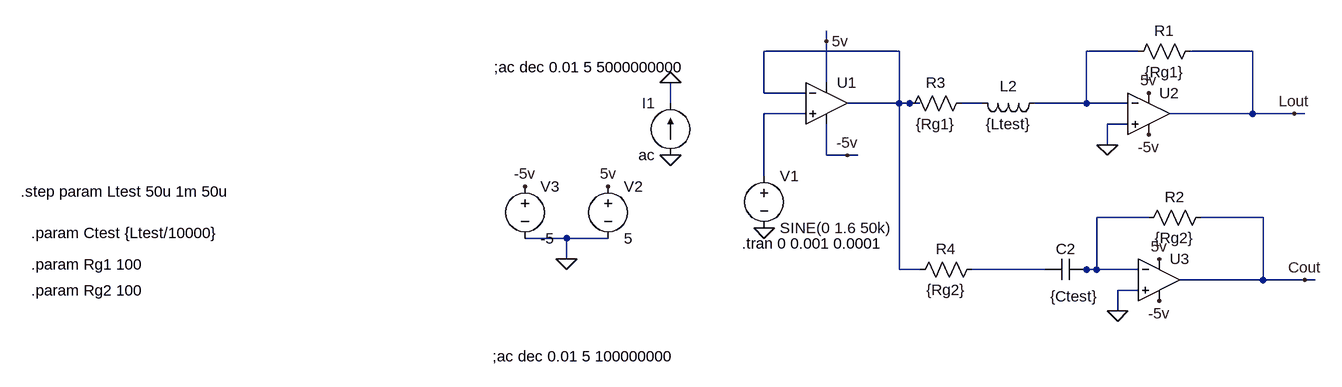
[diagram p0: schematic RLC_idealopamp.asc]
RLC_idealopamp.asc, the LTspice schematic file:
Version 4
SHEET 1 964 680
WIRE 112 32 112 16
WIRE 224 48 16 48
WIRE 592 48 512 48
WIRE 768 48 672 48
WIRE 112 96 112 32
WIRE 16 112 16 48
WIRE 80 112 16 112
WIRE -128 128 -128 96
WIRE 224 128 224 48
WIRE 224 128 144 128
WIRE 240 128 224 128
WIRE 256 128 240 128
WIRE 352 128 320 128
WIRE 512 128 512 48
WIRE 512 128 432 128
WIRE 576 128 512 128
WIRE 80 144 16 144
WIRE 768 144 768 48
WIRE 768 144 640 144
WIRE 832 144 768 144
WIRE 848 144 832 144
WIRE 576 160 544 160
WIRE 544 192 544 160
WIRE 112 208 112 160
WIRE 144 208 112 208
WIRE 160 208 144 208
WIRE 16 240 16 144
WIRE 608 304 528 304
WIRE 784 304 688 304
WIRE -288 336 -352 336
WIRE -224 336 -288 336
WIRE -288 368 -288 336
WIRE 224 384 224 128
WIRE 256 384 224 384
WIRE 448 384 336 384
WIRE 512 384 496 384
WIRE 528 384 528 304
WIRE 528 384 512 384
WIRE 592 384 528 384
WIRE 784 400 784 304
WIRE 784 400 656 400
WIRE 848 400 784 400
WIRE 864 400 848 400
WIRE 592 416 560 416
WIRE 560 448 560 416
FLAG 16 320 0
FLAG 544 192 0
FLAG -288 368 0
FLAG -224 256 5v
FLAG 112 32 5v
FLAG 608 112 5v
FLAG -352 256 -5v
FLAG 144 208 -5v
FLAG 608 176 -5v
FLAG 560 448 0
FLAG 624 368 5v
FLAG 624 432 -5v
FLAG 848 400 Cout
FLAG 832 144 Lout
FLAG -128 208 0
FLAG -128 96 0
SYMBOL voltage 16 224 R0
WINDOW 123 0 0 Left 0
WINDOW 39 0 0 Left 0
SYMATTR InstName V1
SYMATTR Value SINE(0 1.6 50k)
SYMBOL res 688 32 R90
WINDOW 0 0 56 VBottom 2
WINDOW 3 32 56 VTop 2
SYMATTR InstName R1
SYMATTR Value {Rg1}
SYMBOL OpAmps\\UniversalOpAmp 112 128 R0
SYMATTR InstName U1
SYMBOL OpAmps\\UniversalOpAmp 608 144 R0
SYMATTR InstName U2
SYMBOL voltage -224 240 R0
WINDOW 123 0 0 Left 0
WINDOW 39 0 0 Left 0
SYMATTR InstName V2
SYMATTR Value 5
SYMBOL voltage -352 240 R0
WINDOW 123 0 0 Left 0
WINDOW 39 0 0 Left 0
SYMATTR InstName V3
SYMATTR Value -5
SYMBOL res 704 288 R90
WINDOW 0 0 56 VBottom 2
WINDOW 3 32 56 VTop 2
SYMATTR InstName R2
SYMATTR Value {Rg2}
SYMBOL OpAmps\\UniversalOpAmp 624 400 R0
SYMATTR InstName U3
SYMBOL cap 512 368 R90
WINDOW 0 0 32 VBottom 2
WINDOW 3 42 19 VTop 2
SYMATTR InstName C2
SYMATTR Value {Ctest}
SYMATTR SpiceLine Rser=0.1 Lser=0.1p
SYMBOL current -128 208 R180
WINDOW 0 24 80 Left 2
WINDOW 3 24 0 Left 2
SYMATTR InstName I1
SYMATTR Value ac
SYMBOL ind 448 112 R90
WINDOW 0 5 56 VBottom 2
WINDOW 3 32 56 VTop 2
SYMATTR InstName L2
SYMATTR Value {Ltest}
SYMATTR SpiceLine Ipk=5 Rser=15.1m Cpar=0.5p
SYMBOL res 336 112 R90
WINDOW 0 0 56 VBottom 2
WINDOW 3 32 56 VTop 2
SYMATTR InstName R3
SYMATTR Value {Rg1}
SYMBOL res 352 368 R90
WINDOW 0 0 56 VBottom 2
WINDOW 3 32 56 VTop 2
SYMATTR InstName R4
SYMATTR Value {Rg2}
TEXT -18 344 Left 2 !.tran 0 0.001 0.0001
TEXT -400 72 Left 2 !;ac dec 0.01 5 5000000000
TEXT -402 518 Left 2 !;ac dec 0.01 5 100000000
TEXT -1128 264 Left 2 !.step param Ltest 50u 1m 50u
TEXT -1112 328 Left 2 !.param Ctest {Ltest/10000}
TEXT -1112 376 Left 2 !.param Rg1 100
TEXT -1112 416 Left 2 !.param Rg2 100

The netlist it stands for:
* RLC_idealopamp.asc
V1 N004 0 SINE(0 1.6 50k)
R1 Lout N002 {Rg1}
XU1 N004 N001 5v -5v N001 level1 Avol=1Meg GBW=10Meg Vos=0 En=0 Enk=0 In=0 Ink=0 Rin=500Meg  ; pins In+ In- V+ V- OUT
XU2 0 N002 5v -5v Lout level1 Avol=1Meg GBW=10Meg Vos=0 En=0 Enk=0 In=0 Ink=0 Rin=500Meg  ; pins In+ In- V+ V- OUT
V2 5v 0 5
V3 -5v 0 -5
R2 Cout N005 {Rg2}
XU3 0 N005 5v -5v Cout level1 Avol=1Meg GBW=10Meg Vos=0 En=0 Enk=0 In=0 Ink=0 Rin=500Meg  ; pins In+ In- V+ V- OUT
C2 N005 N006 {Ctest} Rser=0.1 Lser=0.1p
I1 0 0 ac
L2 N002 N003 {Ltest} Ipk=5 Rser=15.1m Cpar=0.5p
R3 N003 N001 {Rg1}
R4 N006 N001 {Rg2}
.tran 0 0.001 0.0001
;ac dec 0.01 5 5000000000
;ac dec 0.01 5 100000000
.step param Ltest 50u 1m 50u
.param Ctest {Ltest/10000}
.param Rg1 100
.param Rg2 100
.lib UniversalOpAmp1.lib
.backanno
.end